# EAGLE design motortest (EAGLE 5.09)
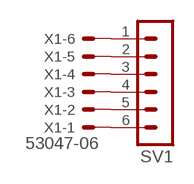
[diagram p0: schematic, sheet 1]

## Parts
SV1  MA06-1  [MA06-1]
X1  53047-06  [53047-06]

## Nets
N$1: SV1.6 X1.1
N$2: SV1.5 X1.2
N$3: SV1.4 X1.3
N$4: SV1.3 X1.4
N$5: SV1.2 X1.5
N$6: SV1.1 X1.6

## Library data of the parts
SV1 = con-lstb:MA06-1: PIN HEADER
X1 = con-molex:53?-06: CONNECTOR wire to board 1.25 mm (.049 inch) pitch header

## Board
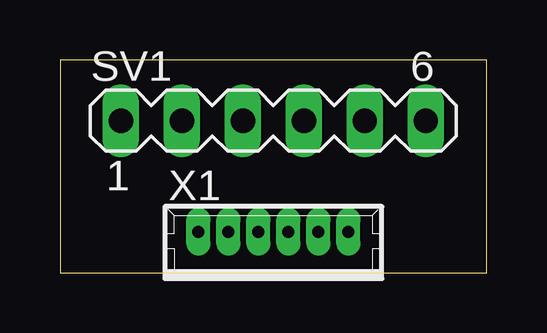
[diagram p1: board, top side]
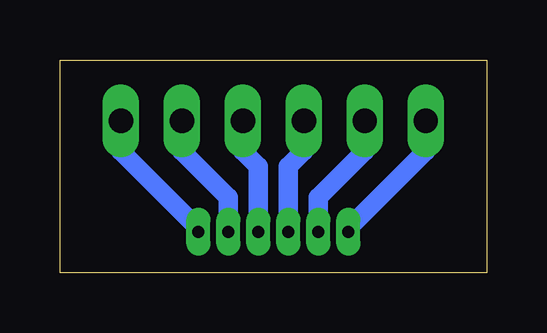
[diagram p2: board, bottom side, seen from below]

Size 17.78 x 8.89 mm. Coordinates in mm from the lower left corner, seen from the top.
Outline: 0,0 17.78,0 17.78,8.89 0,8.88 0,0
Copper layers (1*16): Top 0.035mm / dielectric 1.5mm / Bottom 0.035mm
Design rules "default": minimum track width 10mil, minimum drill 0.6mm, track to track 8mil, track to pad 8mil, pad to pad 8mil, via to via 8mil, smd to smd 8mil, copper to edge 40mil, drill to drill 8mil, minimum pad ring 10mil, minimum via ring 8mil, stop-mask expansion 4mil, vias tented up to drill 0mil, thermal gap 10mil

### Footprints (pad centres in the part's own frame; a part is rotated, then mirrored left to right if it is on the bottom)
MA06-1 = drill 1.016 long: 1 -6.35,0; 2 -3.81,0; 3 -1.27,0; 4 1.27,0; 5 3.81,0; 6 6.35,0
53047-06 = drill 0.5 pad 0.698 long: 1 3.125,0.45; 2 1.875,0.45; 3 0.625,0.45; 4 -0.625,0.45; 5 -1.875,0.45; 6 -3.125,0.45

### Placement (x,y rotation side)
SV1  8.89,6.35 0 top
X1  8.89,1.27 0 top

### Tracks (layer width: path | path; a pad name or v marks a point on that pad's centre or on a via)
N$1
  Bottom 0.813: X1.1 12.02,1.85 15.24,5.08 SV1.6
N$2
  Bottom 0.813: X1.2 10.77,3.14 12.7,5.08 SV1.5
N$3
  Bottom 0.813: X1.3 9.52,4.43 10.16,5.08 SV1.4
N$4
  Bottom 0.813: X1.4 8.27,4.43 7.62,5.08 SV1.3
N$5
  Bottom 0.813: X1.5 7.01,3.14 5.08,5.08 SV1.2
N$6
  Bottom 0.813: X1.6 5.76,1.85 2.54,5.08 SV1.1